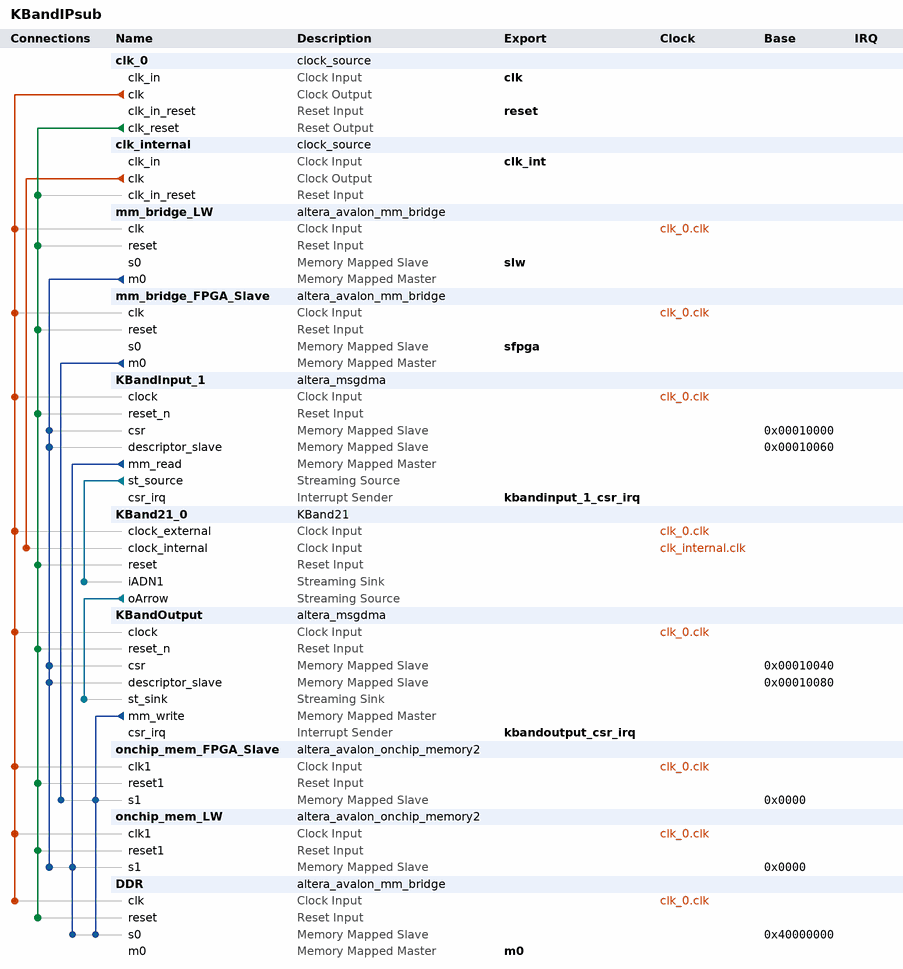
[diagram p0: system contents]
# Platform Designer (Qsys) system KBandIPsub, Cyclone V 5CSEBA6U23I7
# Parameters at their usual value, and those the tool derives, are not listed.
package require -exact qsys 16.1
create_system KBandIPsub
set_project_property DEVICE_FAMILY {Cyclone V}
set_project_property DEVICE 5CSEBA6U23I7

add_instance clk_0 clock_source 16.1
set_instance_parameter_value clk_0 clockFrequency 250000000

add_instance clk_internal clock_source 16.1
set_instance_parameter_value clk_internal clockFrequency 50000000

add_instance mm_bridge_LW altera_avalon_mm_bridge 16.1
set_instance_parameter_value mm_bridge_LW ADDRESS_UNITS SYMBOLS
set_instance_parameter_value mm_bridge_LW ADDRESS_WIDTH 17
set_instance_parameter_value mm_bridge_LW DATA_WIDTH 32
set_instance_parameter_value mm_bridge_LW MAX_PENDING_RESPONSES 4
set_instance_parameter_value mm_bridge_LW USE_AUTO_ADDRESS_WIDTH 0

add_instance mm_bridge_FPGA_Slave altera_avalon_mm_bridge 16.1
set_instance_parameter_value mm_bridge_FPGA_Slave ADDRESS_UNITS SYMBOLS
set_instance_parameter_value mm_bridge_FPGA_Slave ADDRESS_WIDTH 18
set_instance_parameter_value mm_bridge_FPGA_Slave DATA_WIDTH 64
set_instance_parameter_value mm_bridge_FPGA_Slave MAX_PENDING_RESPONSES 4
set_instance_parameter_value mm_bridge_FPGA_Slave USE_AUTO_ADDRESS_WIDTH 0

add_instance KBandInput_1 altera_msgdma 16.1
set_instance_parameter_value KBandInput_1 BURST_ENABLE 0
set_instance_parameter_value KBandInput_1 DATA_FIFO_DEPTH 32
set_instance_parameter_value KBandInput_1 DATA_WIDTH 32
set_instance_parameter_value KBandInput_1 DESCRIPTOR_FIFO_DEPTH 128
set_instance_parameter_value KBandInput_1 ENHANCED_FEATURES 0
set_instance_parameter_value KBandInput_1 ERROR_ENABLE 0
set_instance_parameter_value KBandInput_1 MAX_BURST_COUNT 2
set_instance_parameter_value KBandInput_1 MAX_BYTE 4096
set_instance_parameter_value KBandInput_1 MODE 1
set_instance_parameter_value KBandInput_1 PACKET_ENABLE 0
set_instance_parameter_value KBandInput_1 TRANSFER_TYPE {Full Word Accesses Only}

add_instance KBand21_0 KBand21 1.0
set_instance_parameter_value KBand21_0 NoCell 1024
set_instance_parameter_value KBand21_0 bitsOUT 128
set_instance_parameter_value KBand21_0 dimADN 3
set_instance_parameter_value KBand21_0 dimH 5
set_instance_parameter_value KBand21_0 dimSymbol 32
set_instance_parameter_value KBand21_0 widthu 3

add_instance KBandOutput altera_msgdma 16.1
set_instance_parameter_value KBandOutput BURST_ENABLE 0
set_instance_parameter_value KBandOutput DATA_FIFO_DEPTH 32
set_instance_parameter_value KBandOutput DATA_WIDTH 128
set_instance_parameter_value KBandOutput DESCRIPTOR_FIFO_DEPTH 128
set_instance_parameter_value KBandOutput ENHANCED_FEATURES 0
set_instance_parameter_value KBandOutput ERROR_ENABLE 0
set_instance_parameter_value KBandOutput MAX_BURST_COUNT 2
set_instance_parameter_value KBandOutput MAX_BYTE 524288
set_instance_parameter_value KBandOutput MODE 2
set_instance_parameter_value KBandOutput PACKET_ENABLE 0
set_instance_parameter_value KBandOutput TRANSFER_TYPE {Aligned Accesses}

add_instance onchip_mem_FPGA_Slave altera_avalon_onchip_memory2 16.1
set_instance_parameter_value onchip_mem_FPGA_Slave dataWidth 128
set_instance_parameter_value onchip_mem_FPGA_Slave dualPort false
set_instance_parameter_value onchip_mem_FPGA_Slave initMemContent true
set_instance_parameter_value onchip_mem_FPGA_Slave initializationFileName onchip_mem.hex
set_instance_parameter_value onchip_mem_FPGA_Slave memorySize 262144

add_instance onchip_mem_LW altera_avalon_onchip_memory2 16.1
set_instance_parameter_value onchip_mem_LW dataWidth 128
set_instance_parameter_value onchip_mem_LW dualPort false
set_instance_parameter_value onchip_mem_LW initMemContent true
set_instance_parameter_value onchip_mem_LW initializationFileName onchip_mem.hex
set_instance_parameter_value onchip_mem_LW memorySize 4096

add_instance DDR altera_avalon_mm_bridge 16.1
set_instance_parameter_value DDR ADDRESS_UNITS SYMBOLS
set_instance_parameter_value DDR ADDRESS_WIDTH 30
set_instance_parameter_value DDR DATA_WIDTH 128
set_instance_parameter_value DDR MAX_BURST_SIZE 16
set_instance_parameter_value DDR MAX_PENDING_RESPONSES 4
set_instance_parameter_value DDR USE_AUTO_ADDRESS_WIDTH 0

# connections
add_connection clk_0.clk DDR.clk clock
add_connection clk_0.clk KBand21_0.clock_external clock
add_connection clk_0.clk KBandInput_1.clock clock
add_connection clk_0.clk KBandOutput.clock clock
add_connection clk_0.clk mm_bridge_FPGA_Slave.clk clock
add_connection clk_0.clk mm_bridge_LW.clk clock
add_connection clk_0.clk onchip_mem_FPGA_Slave.clk1 clock
add_connection clk_0.clk onchip_mem_LW.clk1 clock
add_connection clk_internal.clk KBand21_0.clock_internal clock
add_connection clk_0.clk_reset clk_internal.clk_in_reset reset
add_connection clk_0.clk_reset DDR.reset reset
add_connection clk_0.clk_reset KBand21_0.reset reset
add_connection clk_0.clk_reset KBandInput_1.reset_n reset
add_connection clk_0.clk_reset KBandOutput.reset_n reset
add_connection clk_0.clk_reset mm_bridge_FPGA_Slave.reset reset
add_connection clk_0.clk_reset mm_bridge_LW.reset reset
add_connection clk_0.clk_reset onchip_mem_FPGA_Slave.reset1 reset
add_connection clk_0.clk_reset onchip_mem_LW.reset1 reset
add_connection KBandInput_1.mm_read DDR.s0 avalon
set_connection_parameter_value KBandInput_1.mm_read/DDR.s0 baseAddress 0x40000000
add_connection KBandInput_1.mm_read onchip_mem_LW.s1 avalon
set_connection_parameter_value KBandInput_1.mm_read/onchip_mem_LW.s1 baseAddress 0x0000
add_connection KBandOutput.mm_write DDR.s0 avalon
set_connection_parameter_value KBandOutput.mm_write/DDR.s0 baseAddress 0x40000000
add_connection KBandOutput.mm_write onchip_mem_FPGA_Slave.s1 avalon
set_connection_parameter_value KBandOutput.mm_write/onchip_mem_FPGA_Slave.s1 baseAddress 0x0000
add_connection mm_bridge_FPGA_Slave.m0 onchip_mem_FPGA_Slave.s1 avalon
set_connection_parameter_value mm_bridge_FPGA_Slave.m0/onchip_mem_FPGA_Slave.s1 baseAddress 0x0000
add_connection mm_bridge_LW.m0 KBandInput_1.csr avalon
set_connection_parameter_value mm_bridge_LW.m0/KBandInput_1.csr baseAddress 0x00010000
add_connection mm_bridge_LW.m0 KBandInput_1.descriptor_slave avalon
set_connection_parameter_value mm_bridge_LW.m0/KBandInput_1.descriptor_slave baseAddress 0x00010060
add_connection mm_bridge_LW.m0 KBandOutput.csr avalon
set_connection_parameter_value mm_bridge_LW.m0/KBandOutput.csr baseAddress 0x00010040
add_connection mm_bridge_LW.m0 KBandOutput.descriptor_slave avalon
set_connection_parameter_value mm_bridge_LW.m0/KBandOutput.descriptor_slave baseAddress 0x00010080
add_connection mm_bridge_LW.m0 onchip_mem_LW.s1 avalon
set_connection_parameter_value mm_bridge_LW.m0/onchip_mem_LW.s1 baseAddress 0x0000
add_connection KBand21_0.oArrow KBandOutput.st_sink avalon_streaming
add_connection KBandInput_1.st_source KBand21_0.iADN1 avalon_streaming

# exported interfaces
add_interface clk clock sink
set_interface_property clk EXPORT_OF clk_0.clk_in
add_interface clk_int clock sink
set_interface_property clk_int EXPORT_OF clk_internal.clk_in
add_interface kbandinput_1_csr_irq interrupt sender
set_interface_property kbandinput_1_csr_irq EXPORT_OF KBandInput_1.csr_irq
add_interface kbandoutput_csr_irq interrupt sender
set_interface_property kbandoutput_csr_irq EXPORT_OF KBandOutput.csr_irq
add_interface m0 avalon master
set_interface_property m0 EXPORT_OF DDR.m0
add_interface reset reset sink
set_interface_property reset EXPORT_OF clk_0.clk_in_reset
add_interface sfpga avalon slave
set_interface_property sfpga EXPORT_OF mm_bridge_FPGA_Slave.s0
add_interface slw avalon slave
set_interface_property slw EXPORT_OF mm_bridge_LW.s0

set_interconnect_requirement {$system} qsys_mm.clockCrossingAdapter HANDSHAKE
set_interconnect_requirement {$system} qsys_mm.enableEccProtection FALSE
set_interconnect_requirement {$system} qsys_mm.insertDefaultSlave FALSE
set_interconnect_requirement {$system} qsys_mm.maxAdditionalLatency 1

save_system KBandIPsub.qsys
